# Altium schematic sheet STM.SchDoc
size 420 x 297 mm
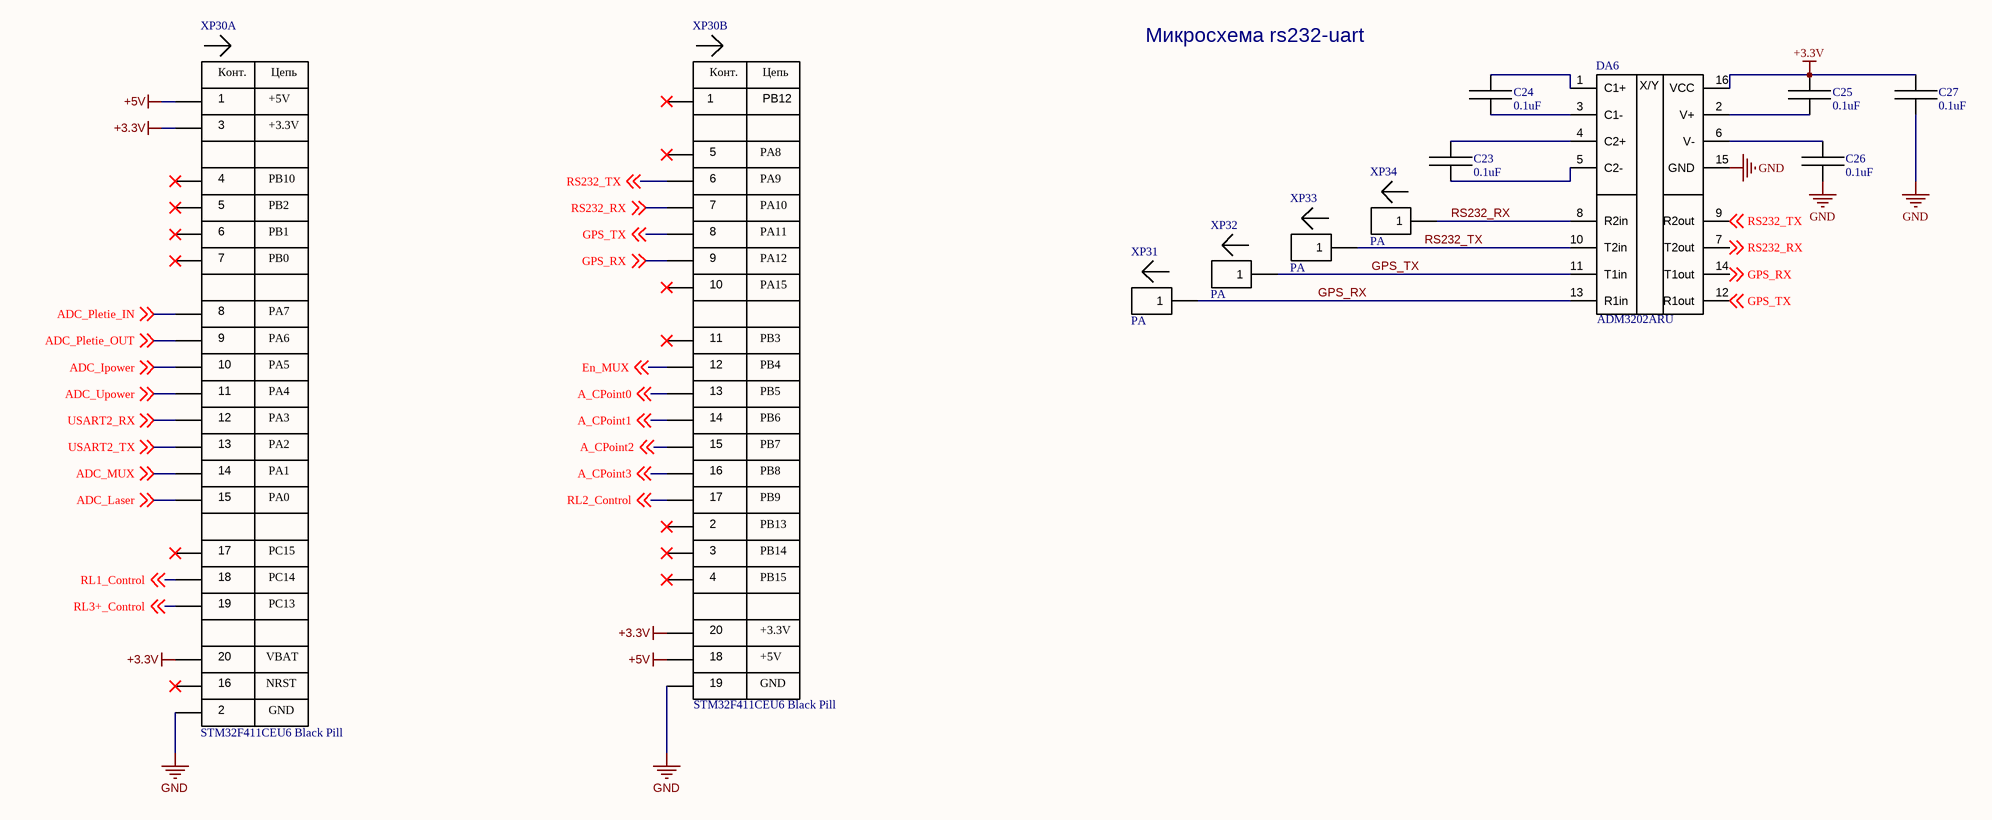
[diagram p0: STM.SchDoc]

## Parts
C23  0.1uF  [0805C]
C24  0.1uF  [0805C]
C25  0.1uF  [0805C]
C26  0.1uF  [0805C]
C27  0.1uF  [0805C]
DA6  ADM3202ARU  [TSSOP-16]
XP30  STM32F411CEU6 Black Pill  [Black pill STM32F411CEU6]  (parts A,B of 2)
XP31  PA  [POGO PIN P100-A2/B1]
XP32  PA  [POGO PIN P100-A2/B1]
XP33  PA  [POGO PIN P100-A2/B1]
XP34  PA  [POGO PIN P100-A2/B1]

## Nets
+3.3V: C25.2 C27.2 DA6.16(VCC) XP30.3(+3.3V) XP30.20(VBAT) XP30.40(+3.3V)
+5V: XP30.1(+5V) XP30.38(+5V)
GND: C26.1 C27.1 DA6.15(GND) XP30.2(GND) XP30.39(GND)
A_CPoint0: XP30.33(PB5) ; off-sheet A_CPoint0
A_CPoint1: XP30.34(PB6) ; off-sheet A_CPoint1
A_CPoint2: XP30.35(PB7) ; off-sheet A_CPoint2
A_CPoint3: XP30.36(PB8) ; off-sheet A_CPoint3
ADC_Ipower: XP30.10(PA5) ; off-sheet ADC_Ipower
ADC_Laser: XP30.15(PA0) ; off-sheet ADC_Laser
ADC_MUX: XP30.14(PA1) ; off-sheet ADC_MUX
ADC_Pletie_IN: XP30.8(PA7) ; off-sheet ADC_Pletie_IN
ADC_Pletie_OUT: XP30.9(PA6) ; off-sheet ADC_Pletie_OUT
ADC_Upower: XP30.11(PA4) ; off-sheet ADC_Upower
En_MUX: XP30.32(PB4) ; off-sheet En_MUX
GPS_RX: DA6.13(R1in) DA6.14(T1out) XP30.29(PA12) XP31.1 ; off-sheet GPS_RX
GPS_TX: DA6.11(T1in) DA6.12(R1out) XP30.28(PA11) XP32.1 ; off-sheet GPS_TX
RL1_Control: XP30.18(PC14) ; off-sheet RL1_Control
RL2_Control: XP30.37(PB9) ; off-sheet RL2_Control
RL3+_Control: XP30.19(PC13) ; off-sheet RL3+_Control
RS232_RX: DA6.7(T2out) DA6.8(R2in) XP30.27(PA10) XP34.1 ; off-sheet RS232_RX
RS232_TX: DA6.9(R2out) DA6.10(T2in) XP30.26(PA9) XP33.1 ; off-sheet RS232_TX
USART2_RX: XP30.12(PA3) ; off-sheet USART2_RX
USART2_TX: XP30.13(PA2) ; off-sheet USART2_TX
NetC23_1: C23.1 DA6.5(C2-)
NetC23_2: C23.2 DA6.4(C2+)
NetC24_1: C24.1 DA6.3(C1-)
NetC24_2: C24.2 DA6.1(C1+)
NetC25_1: C25.1 DA6.2(V+)
NetC26_2: C26.2 DA6.6(V-)

Not connected (* = marked no-connect by the designer): XP30 4(PB10)* 5(PB2)* 6(PB1)* 7(PB0)* 16(NRST)* 17(PC15)* 21(PB12)* 22(PB13)* 23(PB14)* 24(PB15)* 25(PA8)* 30(PA15)* 31(PB3)*

## Notes on the sheet
- Микросхема rs232-uart
- Подп. и дата
- Инв.№ дубл.
- Взам.инв.№
- Подп.и дата
- Инв.№ подл.
- Изм.
- Лист
- № докум.
- Подп.
- Дата
- Формат  A3
- (in symbol ADM3202ARU) X/Y
- (in symbol STM32F411CEU6 Black pil, part A) Конт.; Цепь
- (in symbol STM32F411CEU6 Black pil, part B) Конт.; Цепь

## Library data of the parts
C23-C27 = C0805-0.1UF 10% 50V: C0805 0.1UF 10% 50V; Part Number: SMD CAP CER 0.1UF ±10% 50V X7R 0805; Added_by: anton@teslatec.ru; Solder_Amount: 2; Pkg: 0805; Created_at: 10/01/2023; MountType: SMD; Mount: MOUNT
DA6 = ADM3202ARU: Low Power, 3.3 V, RS-232 / Line Drivers/Receivers; Added_by: irdolgopolowa@yandex.ru; Solder_Amount: 16; Created_at: 29/10/24; Mount: MOUNT; MountType: SMD; Part Number: ADM3202ARU; Pkg: TSSOP-16
XP30 = STM32F411CEU6 Black pil: Mating Part: 2*DS1021-1*20SF11-B; Added_by: irdolgopolowa@yandex.ru; Solder_Amount: 20; Created_at: 29/10/24; Mount: Mount; MountStyle: THM; Pkg: *; Part Number: STM32F411CEU6 Black Pill
XP31-XP34 = P100-A2 / P100-A: Pogo pin, 33.35x1.36; Added_by: irdolgopolowa@yandex.ru; Created_at: 29/10/24; Mount: MOUNT; MountType: THM; Part Number: P100-A2 / P100-A; Pkg: *